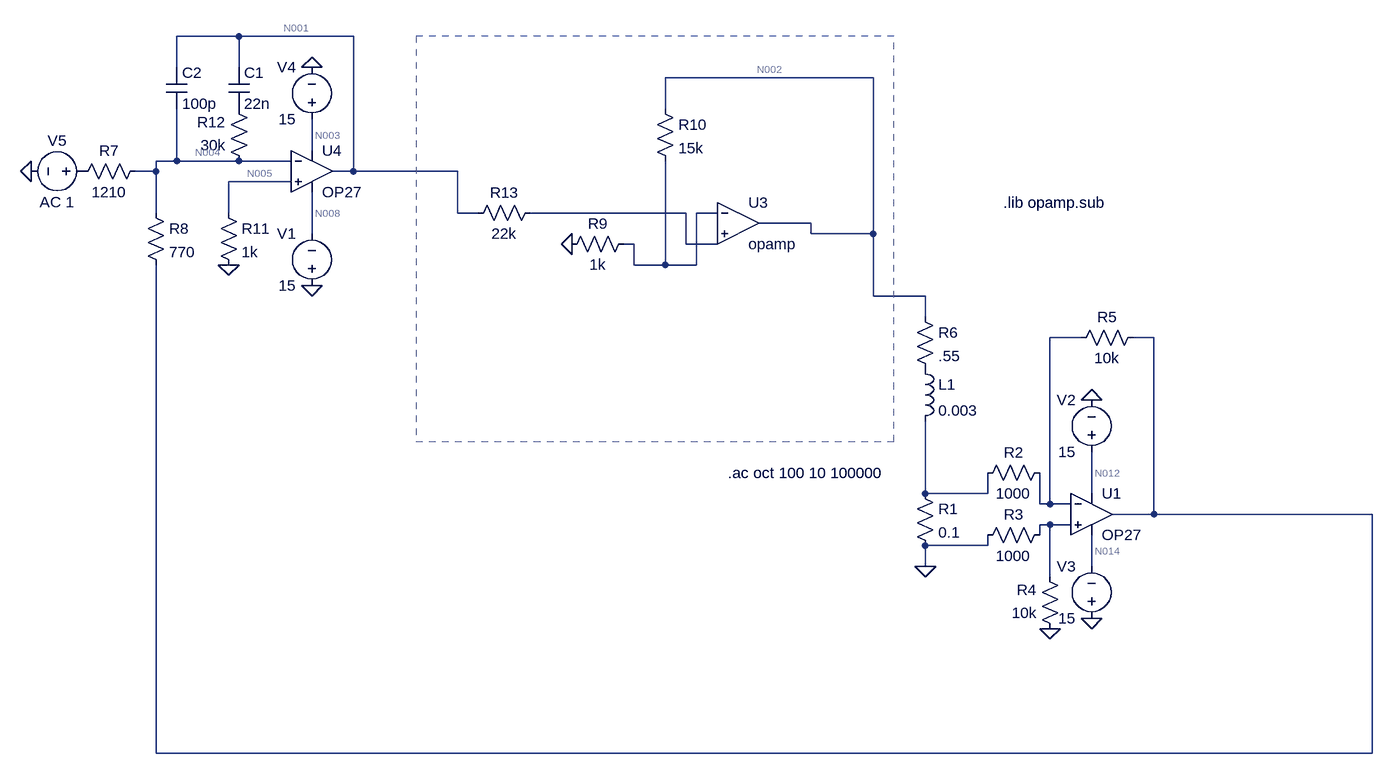
[diagram p0: schematic lm3886_op27_amplifier_v2.asc]
lm3886_op27_amplifier_v2.asc, the LTspice schematic file:
Version 4
SHEET 1 924 680
WIRE -944 -592 -1040 -592
WIRE -768 -592 -944 -592
WIRE -1040 -544 -1040 -592
WIRE -944 -544 -944 -592
WIRE 32 -528 -288 -528
WIRE -288 -480 -288 -528
WIRE -832 -416 -832 -464
WIRE -1040 -400 -1040 -480
WIRE -1040 -400 -1072 -400
WIRE -944 -400 -1040 -400
WIRE -864 -400 -944 -400
WIRE -1072 -384 -1072 -400
WIRE -1072 -384 -1104 -384
WIRE -768 -384 -768 -592
WIRE -768 -384 -800 -384
WIRE -608 -384 -768 -384
WIRE -864 -368 -960 -368
WIRE -1072 -320 -1072 -384
WIRE -960 -320 -960 -368
WIRE -608 -320 -608 -384
WIRE -576 -320 -608 -320
WIRE -256 -320 -496 -320
WIRE -208 -320 -240 -320
WIRE -64 -304 -144 -304
WIRE -832 -288 -832 -352
WIRE -64 -288 -64 -304
WIRE 32 -288 32 -528
WIRE 32 -288 -64 -288
WIRE -336 -272 -352 -272
WIRE -256 -272 -256 -320
WIRE -208 -272 -208 -288
WIRE -208 -272 -256 -272
WIRE -336 -240 -336 -272
WIRE -288 -240 -288 -400
WIRE -288 -240 -336 -240
WIRE -240 -240 -240 -320
WIRE -240 -240 -288 -240
WIRE 32 -192 32 -288
WIRE 112 -192 32 -192
WIRE 112 -160 112 -192
WIRE 352 -128 304 -128
WIRE 464 -128 432 -128
WIRE 112 112 112 0
WIRE 208 112 208 80
WIRE 208 112 112 112
WIRE 368 112 368 48
WIRE 288 128 288 80
WIRE 304 128 304 -128
WIRE 304 128 288 128
WIRE 336 128 304 128
WIRE 464 144 464 -128
WIRE 464 144 400 144
WIRE 800 144 464 144
WIRE 304 160 288 160
WIRE 336 160 304 160
WIRE 288 176 288 160
WIRE 208 192 208 176
WIRE 208 192 112 192
WIRE 112 224 112 192
WIRE 368 224 368 176
WIRE 304 240 304 160
WIRE -1072 512 -1072 -240
WIRE 800 512 800 144
WIRE 800 512 -1072 512
FLAG 304 320 0
FLAG 112 224 0
FLAG 368 304 0
FLAG 368 -32 0
FLAG -432 -272 0
FLAG -1264 -384 0
FLAG -960 -240 0
FLAG -832 -208 0
FLAG -832 -544 0
SYMBOL OpAmps\\OP27 368 80 R0
SYMATTR InstName U1
SYMBOL res 96 96 R0
SYMATTR InstName R1
SYMATTR Value 0.1
SYMBOL res 304 64 R90
WINDOW 0 0 56 VBottom 2
WINDOW 3 32 56 VTop 2
SYMATTR InstName R2
SYMATTR Value 1000
SYMBOL res 304 160 R90
WINDOW 0 0 56 VBottom 2
WINDOW 3 32 56 VTop 2
SYMATTR InstName R3
SYMATTR Value 1000
SYMBOL res 320 336 R180
WINDOW 0 36 76 Left 2
WINDOW 3 36 40 Left 2
SYMATTR InstName R4
SYMATTR Value 10k
SYMBOL res 336 -112 R270
WINDOW 0 32 56 VTop 2
WINDOW 3 0 56 VBottom 2
SYMATTR InstName R5
SYMATTR Value 10k
SYMBOL voltage 368 64 R180
WINDOW 0 24 96 Left 2
WINDOW 3 24 16 Left 2
SYMATTR InstName V2
SYMATTR Value 15
SYMBOL voltage 368 320 R180
WINDOW 0 24 96 Left 2
WINDOW 3 24 16 Left 2
SYMATTR InstName V3
SYMATTR Value 15
SYMBOL ind 96 -96 R0
SYMATTR InstName L1
SYMATTR Value 0.003
SYMBOL res 96 -176 R0
SYMATTR InstName R6
SYMATTR Value .55
SYMBOL voltage -1168 -384 R90
WINDOW 0 -32 56 VBottom 2
WINDOW 3 32 56 VTop 2
SYMATTR InstName V5
SYMATTR Value AC 1
SYMBOL res -336 -288 R90
WINDOW 0 0 56 VBottom 2
WINDOW 3 32 56 VTop 2
SYMATTR InstName R9
SYMATTR Value 1k
SYMBOL res -304 -496 R0
SYMATTR InstName R10
SYMATTR Value 15k
SYMBOL OpAmps\\opamp -176 -368 R0
SYMATTR InstName U3
SYMBOL res -1088 -400 R90
WINDOW 0 0 56 VBottom 2
WINDOW 3 32 56 VTop 2
SYMATTR InstName R7
SYMATTR Value 1210
SYMBOL res -1088 -336 R0
SYMATTR InstName R8
SYMATTR Value 770
SYMBOL OpAmps\\OP27 -832 -448 R0
SYMATTR InstName U4
SYMBOL voltage -832 -192 R180
WINDOW 0 24 96 Left 2
WINDOW 3 24 16 Left 2
SYMATTR InstName V1
SYMATTR Value 15
SYMBOL voltage -832 -448 R180
WINDOW 0 24 96 Left 2
WINDOW 3 24 16 Left 2
SYMATTR InstName V4
SYMATTR Value 15
SYMBOL res -976 -336 R0
SYMATTR InstName R11
SYMATTR Value 1k
SYMBOL res -928 -384 R180
WINDOW 0 36 76 Left 2
WINDOW 3 36 40 Left 2
SYMATTR InstName R12
SYMATTR Value 30k
SYMBOL cap -960 -544 R0
SYMATTR InstName C1
SYMATTR Value 22n
SYMBOL res -480 -336 R90
WINDOW 0 0 56 VBottom 2
WINDOW 3 32 56 VTop 2
SYMATTR InstName R13
SYMATTR Value 22k
SYMBOL cap -1056 -544 R0
SYMATTR InstName C2
SYMATTR Value 100p
TEXT -192 80 Left 2 !.ac oct 100 10 100000
TEXT 232 -336 Left 2 !.lib opamp.sub
RECTANGLE Normal 64 -592 -672 32 2

The netlist it stands for:
* lm3886_op27_amplifier_v2.asc
XU1 N013 N009 N012 N014 N010 OP27  ; pins In+ In- V+ V- OUT
R1 N011 0 0.1
R2 N009 N011 1000
R3 N013 0 1000
R4 0 N013 10k
R5 N009 N010 10k
V2 N012 0 15
V3 0 N014 15
L1 P001 N011 0.003
R6 N002 P001 .55
V5 P002 0 AC 1
R9 N007 0 1k
R10 N002 N007 15k
XU3 N007 N006 N002 opamp Aol=100K GBW=10Meg  ; pins invin noninvin out
R7 N004 P002 1210
R8 N004 N010 770
XU4 N005 N004 N003 N008 N001 OP27  ; pins In+ In- V+ V- OUT
V1 0 N008 15
V4 N003 0 15
R11 N005 0 1k
R12 N004 P003 30k
C1 N001 P003 22n
R13 N006 N001 22k
C2 N001 N004 100p
.ac oct 100 10 100000
.lib opamp.sub
.lib ADI.lib
.backanno
.end

* Results of the author's LTspice run, read from the files saved beside the schematic
* Operating Point, zero values left out:
*   V(n012) = 15 V
*   V(n014) = -15 V
*   V(n003) = 15 V
*   V(n008) = -15 V
*   I(V2) = -2.968 mA
*   I(V3) = -2.968 mA
*   I(V1) = -2.968 mA
*   I(V4) = -2.968 mA
*   Ix(u1:3) = 2.968 mA
*   Ix(u1:4) = -2.968 mA
*   Ix(u4:3) = 2.968 mA
*   Ix(u4:4) = -2.968 mA
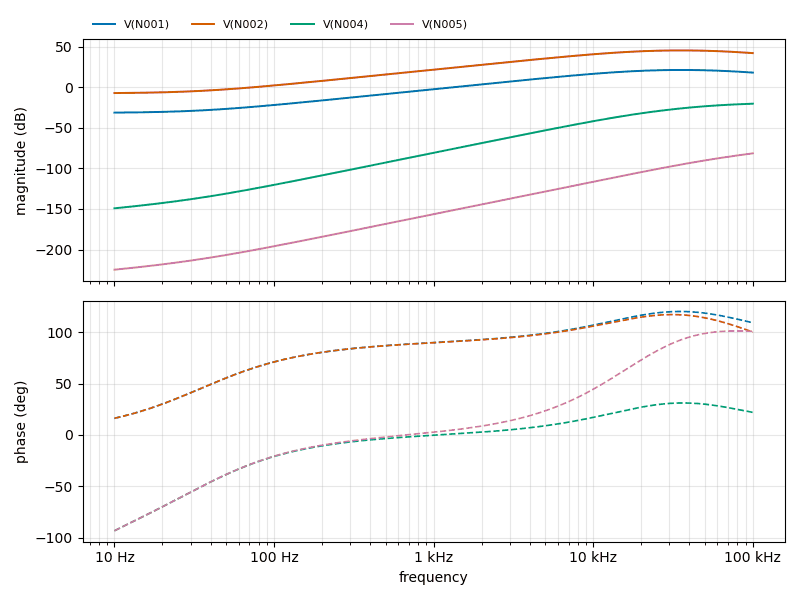
[diagram p1: AC Analysis of lm3886_op27_amplifier_v2.asc, plotted from the saved traces]
* AC Analysis, 1 run:
*   V(N001): -31.38 dB at 10 Hz, 17.90 dB at 100 kHz, peak 21.15 dB at 35.66 kHz, 3 dB below the peak at 13.21 kHz and 95.97 kHz
*   V(N002): -7.30 dB at 10 Hz, 41.87 dB at 100 kHz, peak 45.22 dB at 35.41 kHz, 3 dB below the peak at 13.18 kHz and 94.56 kHz
*   V(N004): -149.21 dB at 10 Hz, -20.41 dB at 100 kHz, peak -20.41 dB at 100 kHz, 3 dB below the peak at 51.1 kHz
*   V(N005): -224.77 dB at 10 Hz, -81.53 dB at 100 kHz, peak -81.53 dB at 100 kHz, 3 dB below the peak at 77.27 kHz